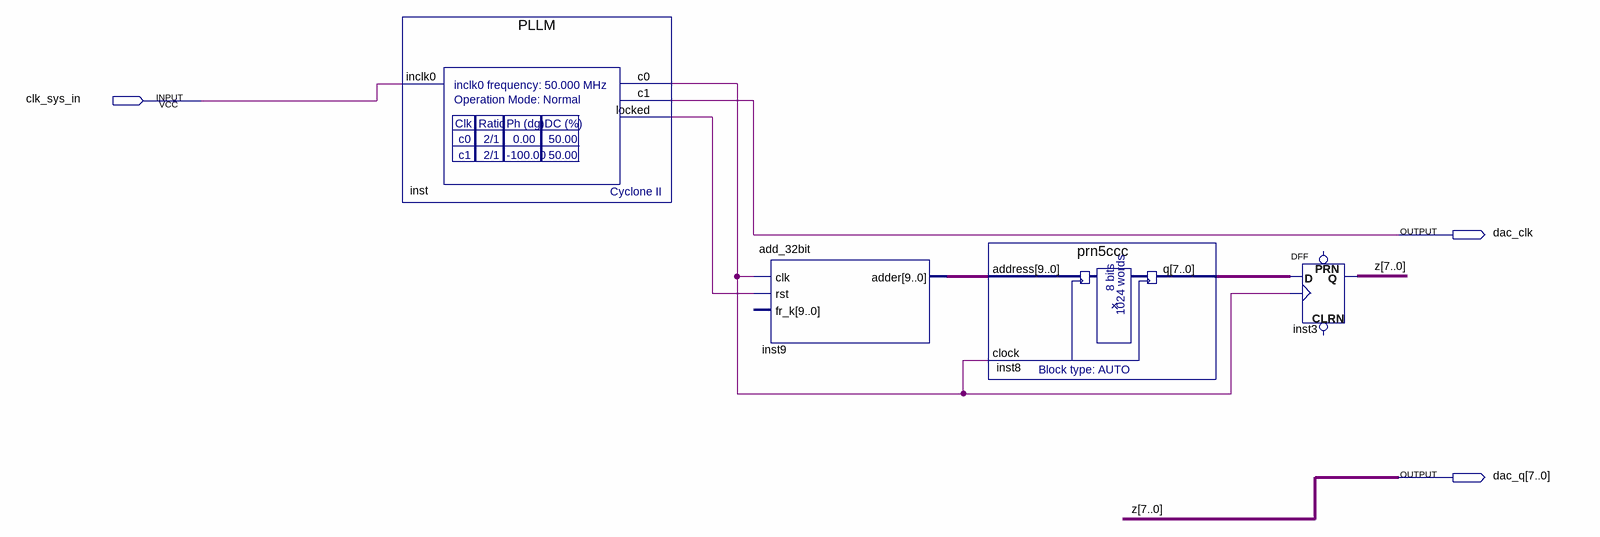
[diagram p0: schematic sheet]
// Quartus schematic AD9708_TEST_Code.bdf as structural Verilog: 4 symbols, 3 pins
module AD9708_TEST_Code (
  input  clk_sys_in,
  output dac_clk,
  output [7:0] dac_q
);

  wire inst_c0, inst_locked;
  wire [7:0] inst8_q;
  wire [9:0] inst9_adder;

  PLLM inst (.inclk0(clk_sys_in), .c0(inst_c0), .c1(dac_clk), .locked(inst_locked));
  add_32bit inst9 (.clk(inst_c0), .rst(inst_locked), .adder(inst9_adder));  // open: fr_k
  prn5ccc inst8 (.address(inst9_adder), .clock(inst_c0), .q(inst8_q));
  DFF inst3[7:0] (.CLK(inst_c0), .D(inst8_q), .Q(dac_q));  // open: CLRN, PRN

  // Other names for the same wires on the sheet: z[7:0] = dac_q
endmodule
